# EAGLE design hello.speaker.45 (EAGLE 8.6.3)
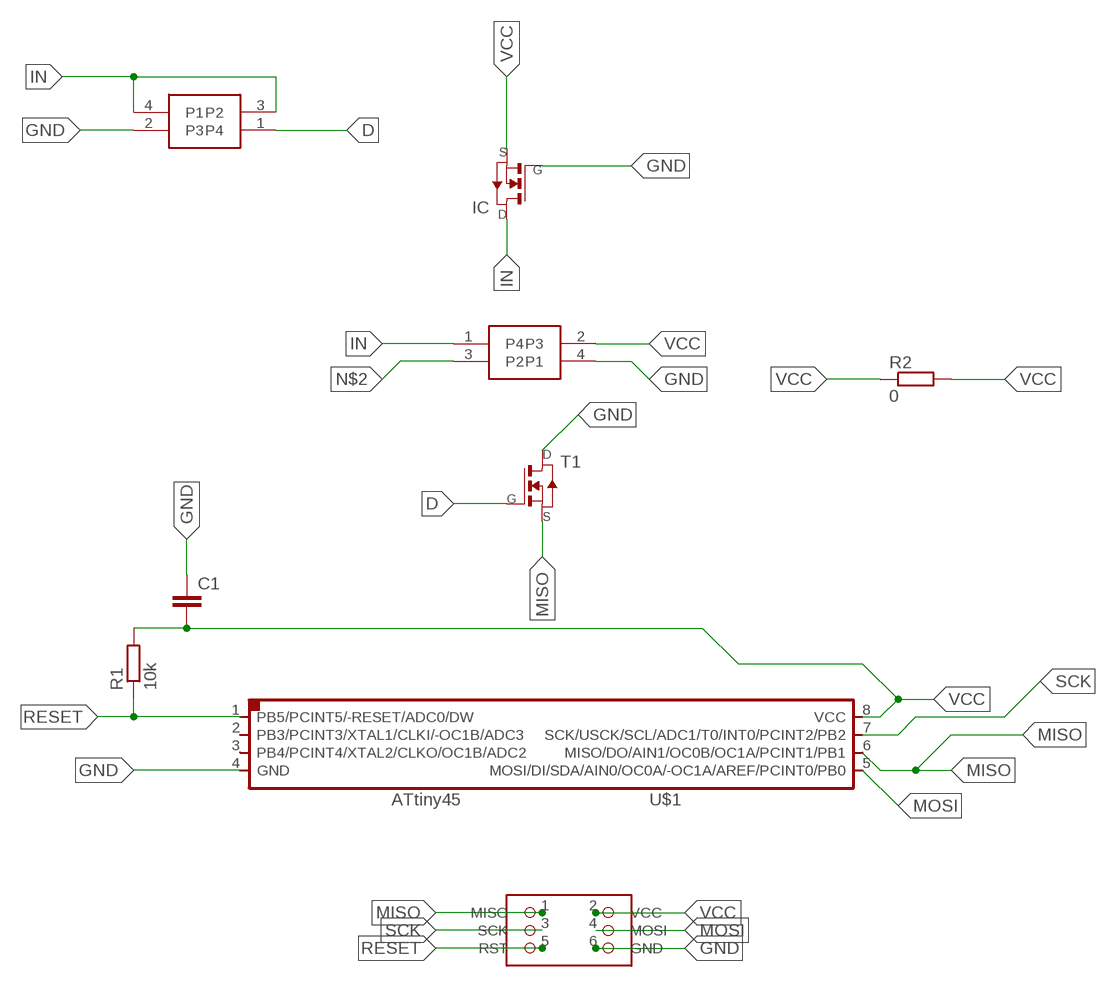
[diagram p0: schematic, sheet 1]

## Parts
C1  C  [C0805]
IC  NMOSFETSOT23  [SOT-23]
R1  10k  R  [R0805]
R2  0  R  [R0805]
T1  NMOSFETSOT23  [SOT-23]
U$1  ATTINY45SI  [SOIC8]
U$2  AVRISPSMD  [2X03SMD]
U$3  4PIN-SMD-CONNECTOR  [2X02SMD]
U$4  4PIN-SMD-CONNECTOR  [2X02SMD]

## Nets
D: T1.3(G) U$3.1(P4)
GND: C1.1 IC.3(G) T1.1(D) U$1.4(GND) U$2.6(GND) U$3.2(P3) U$4.4(P1)
IN: IC.1(D) U$3.3(P2) U$3.4(P1) U$4.1(P4)
MISO: T1.2(S) U$1.6(MISO/DO/AIN1/OC0B/OC1A/PCINT1/PB1) U$2.1(MISO)
MOSI: U$1.5(MOSI/DI/SDA/AIN0/OC0A/-OC1A/AREF/PCINT0/PB0) U$2.4(MOSI)
N$2: U$4.3(P2)
RESET: R1.1 U$1.1(PB5/PCINT5/-RESET/ADC0/DW) U$2.5(RST)
SCK: U$1.7(SCK/USCK/SCL/ADC1/T0/INT0/PCINT2/PB2) U$2.3(SCK)
VCC: C1.2 IC.2(S) R1.2 R2.1 R2.2 U$1.8(VCC) U$2.2(VCC) U$4.2(P3)
Unconnected: U$1.2(PB3/PCINT3/XTAL1/CLKI/-OC1B/ADC3) U$1.3(PB4/PCINT4/XTAL2/CLKO/OC1B/ADC2)

## Library data of the parts
C1 = eagle-ltspice:C: CAPACITOR, European symbol; SPICEMODEL: NONE; SPICEPREFIX: C
IC T1 = fab:NMOSFET: MOS FET
R1 R2 = eagle-ltspice:R: RESISTOR, European symbol; SPICEMODEL: NONE; SPICEPREFIX: R
U$1 = fab:ATTINY45
U$2 = fab:AVRISP
U$3 = fab:4PIN-SMD-CONNECTOR
U$4 = fab:4PIN-SMD-CONNECTOR; SPICEPREFIX: E

## Board
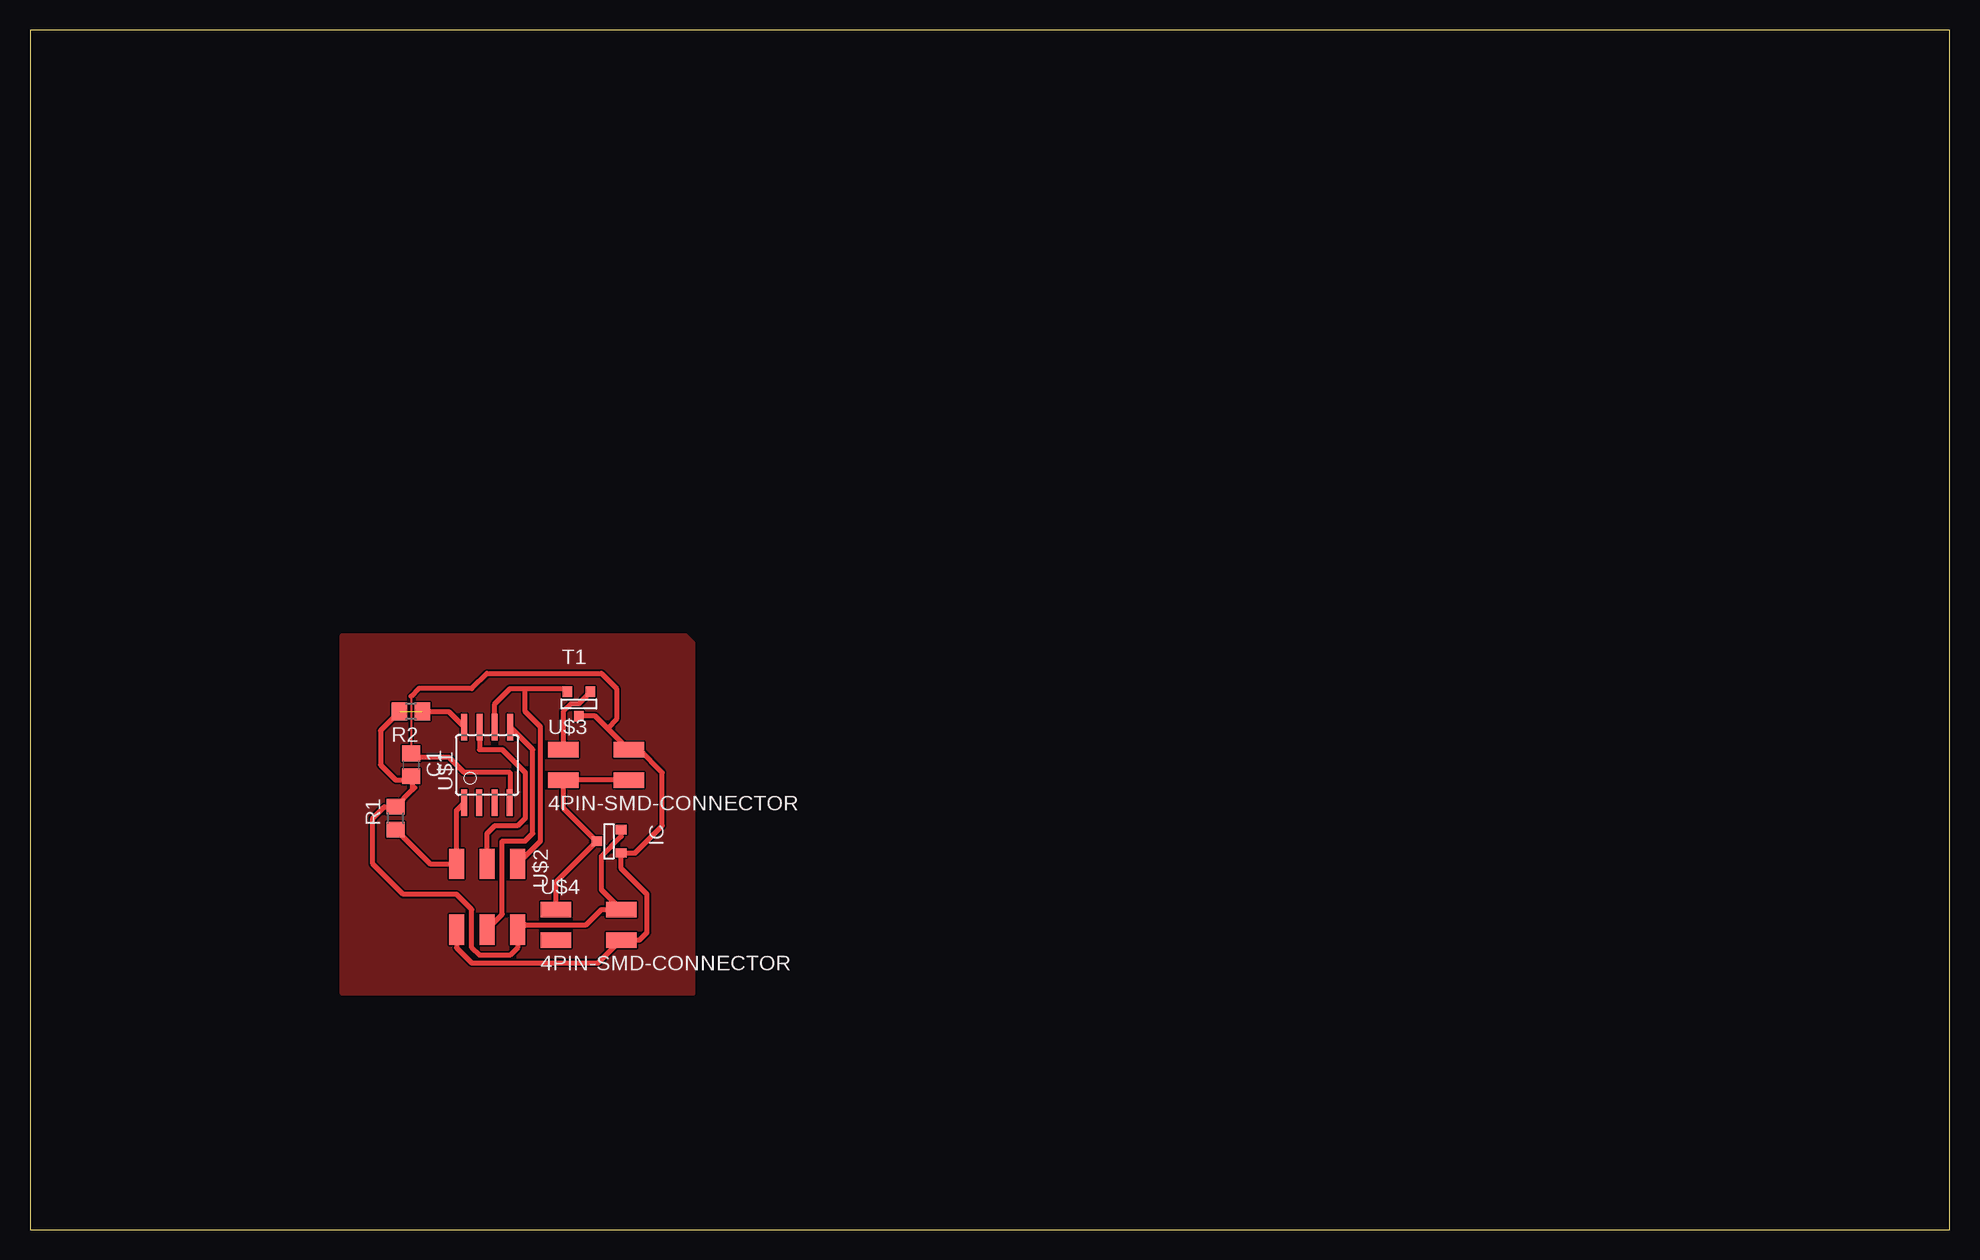
[diagram p1: board, top side]

Size 160 x 100 mm. Coordinates in mm from the lower left corner, seen from the top.
Outline: 0,0 160,0 160,100 0,100 0,0
Copper layers (1*16): Top 0.035mm / dielectric 1.5mm / Bottom 0.035mm
Design rules "default": minimum track width 6mil, minimum drill 0.35mm, track to track 6mil, track to pad 6mil, pad to pad 6mil, via to via 6mil, smd to smd 6mil, copper to edge 40mil, drill to drill 6mil, minimum pad ring 10mil, minimum via ring 8mil, stop-mask expansion 4mil, vias tented up to drill 0mil, thermal gap 10mil

### Footprints (pad centres in the part's own frame; a part is rotated, then mirrored left to right if it is on the bottom)
C0805 = smd 1.3 x 1.5: 1 -0.95,0; 2 0.95,0
SOT-23 = smd 0.787 x 0.889: 1 0.025,-1.016; 2 -0.94,1.016; 3 0.991,1.016
R0805 = smd 1.3 x 1.5: 1 -0.95,0; 2 0.95,0
SOIC8 = smd 0.5 x 2.2: 1 -1.905,-3.154; 2 -0.645,-3.154; 3 0.625,-3.154; 4 1.895,-3.154; 5 1.905,3.154; 6 0.635,3.154; 7 -0.635,3.154; 8 -1.905,3.154
2X03SMD = smd 2.54 x 1.27: 1 -2.54,2.54; 2 2.92,2.54; 3 -2.54,0; 4 2.92,0; 5 -2.54,-2.54; 6 2.92,-2.54
2X02SMD = smd 2.54 x 1.27: 1 -2.54,1.27; 2 2.92,1.27; 3 -2.54,-1.27; 4 2.92,-1.27

### Placement (x,y rotation side)
C1  31.75,38.73 270 top
IC  48.26,32.38 270 top
R1  30.48,34.29 90 top
R2  31.75,43.18 180 top
T1  45.72,43.81 0 top
U$1  38.1,38.73 0 top
U$2  38.1,27.94 270 top
U$3  46.99,38.73 0 top
U$4  46.35,25.4 0 top

### Tracks (layer width: path | path; a pad name or v marks a point on that pad's centre or on a via)
D
  Top 0.406: U$3.1 44.45,43.18 45.09,43.81 45.72,43.81 46.71,44.81 T1.3
GND
  Top 0.152: 31.75,44.45 C1.1
  Top 0.406: U$2.6 35.56,23.5 36.83,22.23 47.37,22.23 U$4.4 50.8,24.13 51.44,24.77 51.44,27.94 49.28,30.1 IC.3 50.44,31.39 52.7,33.66 52.7,38.1 50.8,40.01 U$3.2 48.13,41.78 | 48.13,41.78 47.12,42.8 T1.1 | U$1.4 39.99,36.19 40.01,36.2 40.01,38.1 36.2,38.1 34.92,39.37 32.06,39.37 C1.1 | 48.13,41.78 48.9,42.55 48.9,45.09 47.62,46.35 38.1,46.35 36.83,45.09 32.38,45.09 31.75,44.45
IN
  Top 0.406: U$3.4 U$3.3 44.45,35.15 IC.1 43.81,28.93 U$4.1
MISO
  Top 0.406: U$1.6 38.73,43.81 40.01,45.09 41.27,45.09 | T1.2 44.53,45.09 41.27,45.09 | U$2.1 42.55,32.38 42.55,41.91 41.27,43.18 41.27,45.09
MOSI
  Top 0.406: U$2.4 39.37,26.29 39.37,32.38 41.27,32.38 41.91,33.02 41.91,40.01 40.03,41.89 U$1.5
N$1
  pour Top: 26.04,21.59 26.04,49.53 54.61,49.53 55.24,48.9 55.24,19.68 26.04,19.68
RESET
  Top 0.406: R1.1 33.34,30.48 U$2.5 35.56,34.95 U$1.1
SCK
  Top 0.406: U$2.3 38.1,33.02 38.73,33.66 40.64,33.66 41.27,34.29 41.27,38.1 39.37,40.01 37.47,40.01 U$1.7
VCC  (1 unrouted)
  Top 0.406: IC.2 49.28,32.77 47.62,31.11 47.62,28.32 U$4.2 47.62,26.67 46.35,25.4 41.27,25.4 40.9,25.02 U$2.2 40.64,23.5 40.01,22.86 37.47,22.86 36.83,23.5 36.83,26.67 35.56,27.94 31.11,27.94 28.57,30.48 28.57,34.29 29.52,35.24 R1.2 31.91,36.67 | 31.91,36.67 32.07,36.83 | 31.9,37.69 C1.2 | R2.2 29.21,41.59 29.21,38.73 30.48,37.47 31.68,37.47 31.9,37.69 | R2.1 34.9,43.18 U$1.8 | 31.91,36.67 31.91,37.67 31.9,37.69